# Altium schematic sheet Schematic.SchDoc
size A
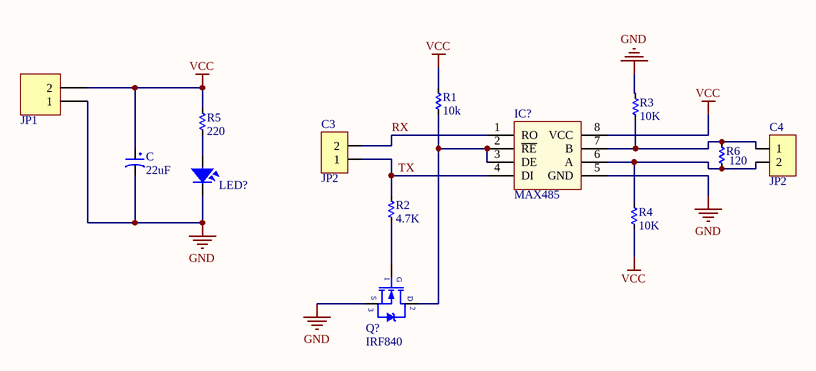
[diagram p0: Schematic.SchDoc]

## Parts
C  22uF  [CP1/2]
C3  JP2  [JP2-D1T]
C4  JP2  [JP2-D1T]
IC?  MAX485  [DIP8/W0.3]
JP1  Header 2_1  [HED2]  (value not drawn)
LED?  LED  [LED-3]  (value not drawn)
Q?  IRF840  [QTO-220]
R1  10k  [RES-1/4W]
R2  4.7K  [RES-1/4W]
R3  10K  [RES-1/4W]
R4  10K  [RES-1/4W]
R5  220  [RES-1/4W]
R6  120  [RES-1/4W]

## Nets
GND: C.2 IC?.5(GND) JP1.1 LED?.2 Q?.3(S) R3.1
VCC: C.1 IC?.8(VCC) JP1.2 R1.1 R4.2 R5.1
RX: C3.2 IC?.1(RO)
TX: C3.1 IC?.4(DI) R2.1
NetC4_1: C4.1 IC?.7(B) R3.2 R6.1
NetC4_2: C4.2 IC?.6(A) R4.1 R6.2
NetIC?_2: IC?.2(~{RE}) IC?.3(DE) Q?.2(D) R1.2
NetLED?_1: LED?.1 R5.2
NetQ?_1: Q?.1(G) R2.2

## Library data of the parts
C = CP1: Cap P  0,1uF < 22uF , 16 - 50V; Value: 10uF/50V; Description 1: 10 => 220uF/6,3V/10V - 10uF => 100uF/16V; Description 2: 0,1uF => 33uF/50V - 10uF => 22uF/63V; Description 3: 0,47uF => 10uF/100V
C3 C4 = JP2: WR-PHD 2.54 mm Angled Socket Header; Manufacturer: W¨¹rth Elektronik eiSos GmbH; partNo: 613002143121; ComponentLink1 Description: Manufacturer; ComponentLink2 Description: Datasheet; NoPins: 02; Created Date: 29 March 2013; ComponentLink1URL: http://www.we-online.com; ComponentLink2URL: http://katalog.we-online.de/em/datasheet/6130xx143121.pdf; Created by: Karrer Zheng
IC? = MAX485: RS232 - RS485 (Same sn75176)
JP1 = Header 2_1: Header, 2-Pin; Manufacturer: Generic Components; Class: Connector; Value: Header 2
LED? = LED: LED Single colour Green and Red; Value: LED 3 ly Single Colour
Q? = IRF840: MOSFET N - CHANNEL 500V - 0.75 - 8A - TO-220; Value: IRF840
R1-R6 = Res: Manufacturer: Generic Components; Class: Passive; SubClass: R; Published: 08/06/2000; Publisher: Altium Hobart Technology Centre